# Altium schematic sheet LedAlert.SchDoc
size A
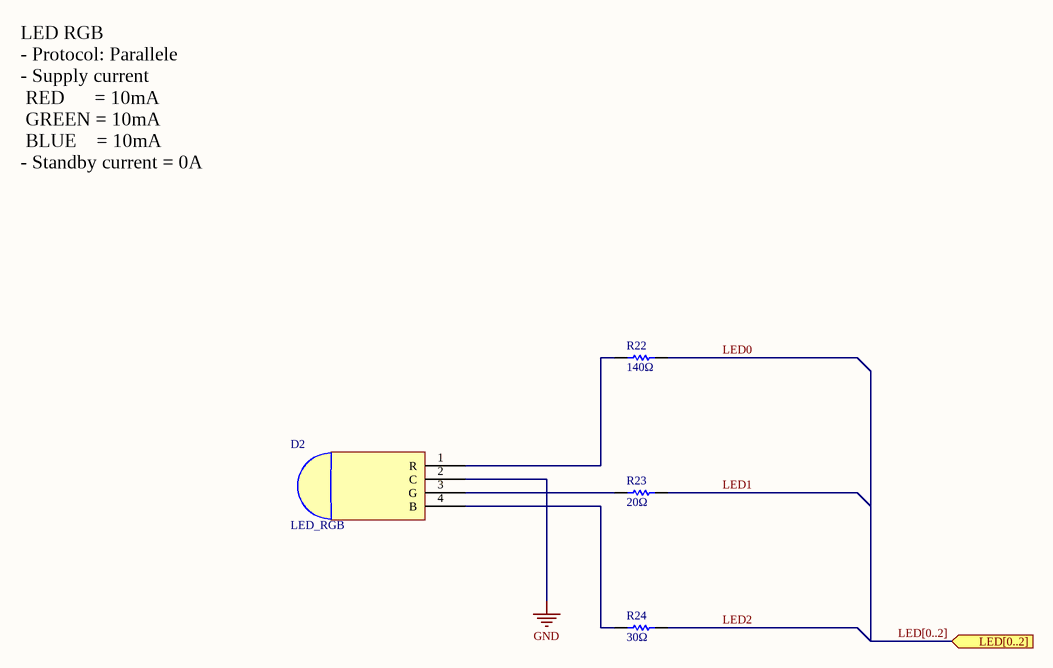
[diagram p0: LedAlert.SchDoc]

## Parts
D2  LED_RGB  [LED1]
R22  140Ω  [R0603]
R23  20Ω  [R0603]
R24  30Ω  [R0603]

## Ports
LED[0..2] (in)

## Nets
GND: D2.2(C)
LED0: R22.2
LED1: R23.2
LED2: R24.2
NetD2_1: D2.1(R) R22.1
NetD2_3: D2.3(G) R23.1
NetD2_4: D2.4(B) R24.1

## Buses and harness runs
bus LED[0..2] = port LED[0..2]

## Notes on the sheet
- LED RGB
  - Protocol: Parallele
  - Supply current
  RED      = 10mA
  GREEN = 10mA
  BLUE    = 10mA
  - Standby current = 0A

## Library data of the parts
D2 = LED_RGB: LedRGB; Manufacturer: KINGBRIGHT; Ref.Manufacturer: L-154A4SURKQBDZGW; Ref.Farnell: 2290374; Supplier: Farnell
R22 = Res1: Resistor; Manufacturer: MULTICOMP; Value: 1K; Published: 8-Jun-2000; LatestRevisionDate: 17-Jul-2002; LatestRevisionNote: Re-released for DXP Platform.; PackageReference: AXIAL-0.3; Publisher: Altium Limited; PackageDescription: Axial Device, Thru-Hole; 2 Leads; 0.3 in Pin Spacing; Ref.Farnell: ?; Supplier: Farnell
R23 = Res1: Resistor; Manufacturer: MULTICOMP; Ref.Manufacturer: MC0063W0603120R; Value: 1K; Published: 8-Jun-2000; LatestRevisionDate: 17-Jul-2002; LatestRevisionNote: Re-released for DXP Platform.; PackageReference: AXIAL-0.3; Publisher: Altium Limited; PackageDescription: Axial Device, Thru-Hole; 2 Leads; 0.3 in Pin Spacing; Ref.Farnell: 9330798; Supplier: Farnell
R24 = Res1: Resistor; Manufacturer: MULTICOMP; Ref.Manufacturer: MC0063W0603130R; Value: 1K; Published: 8-Jun-2000; LatestRevisionDate: 17-Jul-2002; LatestRevisionNote: Re-released for DXP Platform.; PackageReference: AXIAL-0.3; Publisher: Altium Limited; PackageDescription: Axial Device, Thru-Hole; 2 Leads; 0.3 in Pin Spacing; Ref.Farnell: 9331000; Supplier: Farnell